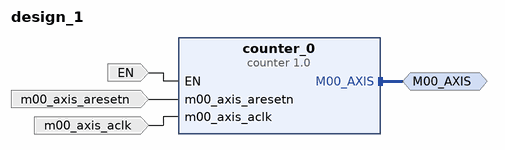
[diagram p0: block diagram of the top level]
# Vivado block design design_1, xc7z010clg400-1, Vivado 2016.4
create_bd_design design_1

create_bd_intf_port -mode Master -vlnv xilinx.com:interface:axis_rtl:1.0 M00_AXIS
create_bd_port -dir I EN
create_bd_port -dir I -type rst m00_axis_aresetn
create_bd_port -dir I -type clk m00_axis_aclk
set_property -dict {CONFIG.FREQ_HZ 100000000} [get_bd_ports m00_axis_aclk]

create_bd_cell -type ip -vlnv xilinx.com:user:counter:1.0 counter_0

# ---- connections ----

connect_bd_intf_net [get_bd_intf_ports M00_AXIS] [get_bd_intf_pins counter_0/M00_AXIS]
connect_bd_net [get_bd_ports EN] [get_bd_pins counter_0/EN]
connect_bd_net [get_bd_ports m00_axis_aresetn] [get_bd_pins counter_0/m00_axis_aresetn]
connect_bd_net [get_bd_ports m00_axis_aclk] [get_bd_pins counter_0/m00_axis_aclk]

validate_bd_design
save_bd_design
